# Altium schematic sheet ASBB_USBUART.SchDoc
size A4
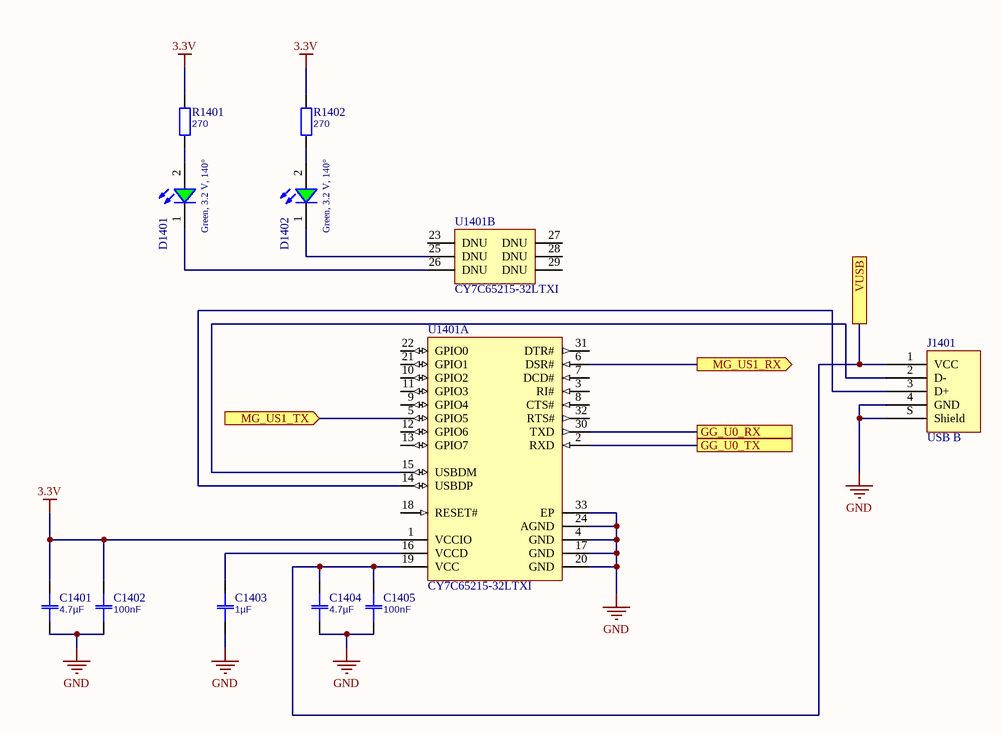
[diagram p0: ASBB_USBUART.SchDoc]

## Parts
C1401  4.7µF  [0603]
C1402  100nF  [0603]
C1403  1µF  [0603]
C1404  4.7µF  [0603]
C1405  100nF  [0603]
D1401  Green, 3.2 V, 140°  [WL-SMCW_0603]
D1402  Green, 3.2 V, 140°  [WL-SMCW_0603]
J1401  USB B  [FCI USB 10118193-0001LF]
R1401  270  [0603]
R1402  270  [0603]
U1401  CY7C65215-32LTXI  [CYP-LTX32_N]  (parts A,B of 2)

## Ports
GG_U0_RX, GG_U0_TX, MG_US1_RX (out), MG_US1_TX (in), VUSB

## Nets
3.3V: C1401.2 C1402.2 R1401.2 R1402.2 U1401.1(VCCIO)
GND: C1401.1 C1402.1 C1403.1 C1404.1 C1405.1 J1401.4(GND) J1401.S(Shield) U1401.4(GND) U1401.17(GND) U1401.20(GND) U1401.24(AGND) U1401.33(EP)
GG_U0_RX: U1401.30(TXD) ; port GG_U0_RX
GG_U0_TX: U1401.2(RXD) ; port GG_U0_TX
MG_US1_RX: U1401.6(DSR#) ; port MG_US1_RX
MG_US1_TX: U1401.5(GPIO5) ; port MG_US1_TX
VUSB: C1404.2 C1405.2 J1401.1(VCC) U1401.19(VCC) ; port VUSB
NetC1403_2: C1403.2 U1401.16(VCCD)
NetD1401_1: D1401.1(K) U1401.26(DNU)
NetD1401_2: D1401.2(A) R1401.1
NetD1402_1: D1402.1(K) U1401.25(DNU)
NetD1402_2: D1402.2(A) R1402.1
NetJ1401_2: J1401.2(D-) U1401.15(USBDM)
NetJ1401_3: J1401.3(D+) U1401.14(USBDP)

Not connected (* = marked no-connect by the designer): U1401 3(RI#) 7(DCD#) 8(CTS#) 9(GPIO4) 10(GPIO2) 11(GPIO3) 12(GPIO6) 13(GPIO7) 18(RESET#) 21(GPIO1) 22(GPIO0) 23(DNU) 27(DNU) 28(DNU) 29(DNU) 31(DTR#) 32(RTS#)

## Library data of the parts
C1401-C1405 = Capacitor: Partnumber: ?; Value: ?
D1401 D1402 = 150060GS75000: WL-SMCW SMD Mono-color Chip LED Waterclear, size 0603, Green, 3.2 V, 140°; Forward Voltage: 3.2 V; Peak Wavelength: 515 nm; Dominant Wavelength: 525 nm; Luminous Intensity: 430 mcd; ComponentLink1Description: Manufacturer; ComponentLink1URL: http://www.we-online.de; ComponentLink2Description: Datasheet; ComponentLink2URL: http://katalog.we-online.de/led/datasheet/150060GS75000.pdf; Part Number: 150060GS75000; Published Date: May 2018; Publisher: Wurth Elektronik; Size: 0603; Viewing Angle: 140°; Operating Temperature: -40 to 85 degC; Emitting Color: Green; Mounting Technology: SMT
J1401 = USB 2.0 Type B
R1401 R1402 = Resistor: Partnumber: ?; Value: ?
U1401 = CY7C65215-32LTXI: USB-Serial Dual Channel (UART/I2C/SPI) Bridge with CapSense(R) and BCD, 0.5 KB, 19 I/Os, 1.71 to 5.5 V, -40 to 85 degC, 32-Pin QFN (LTX32), Tray; Manufacturer: Cypress; CPU Core: M8; Max. Operating Voltage (V): 5.5; Memory Architecture: Flash; Memory Size (KB): 0.5; Min. Operating Voltage (V): 1.71; No. of I/Os: 19; DatasheetVersion: Rev. *F; PackageVersion: Rev. *D, 09/2012; PackageReference: LTX32; PackageDescription: 32-Pin Sawn QFN, Body 5 x 5 mm, Pitch 0.5 mm; Supplier 1: Digi-Key; Supplier Part Number 1: CY7C65215-32LTXI-ND; Supplier 2: Farnell; Supplier Part Number 2: 2345649; Supplier 3: Newark; Supplier Part Number 3: 06X1915; Supplier 4: Mouser; Supplier Part Number 4: 727-CY7C65215-32LTXI; Max. Operating Temp. (degreesC): 85; Min. Operating Temp. (degreesC): -40; Packing: Tray; RoHS: Pb-Free; Mounting Technology: Surface Mount; Code_JEDEC: MO-220; PartNumber: CY7C65215-32LTXI; ComponentLink1Description: Manufacturer URL; ComponentLink1URL: http://www.cypress.com/; ComponentLink2Description: Datasheet; ComponentLink2URL: http://www.cypress.com/?docID=45712; ComponentLink3Description: Package Specification; ComponentLink3URL: http://www.cypress.com/?docID=39513